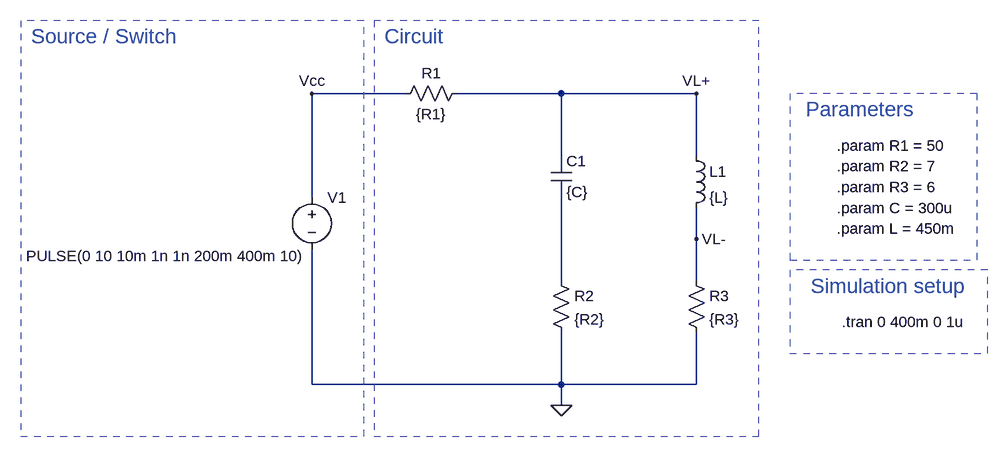
[diagram p0: schematic Simulacion SPICE - Valores Fijos.asc]
Simulacion SPICE - Valores Fijos.asc, the LTspice schematic file:
Version 4
SHEET 1 880 680
WIRE -368 -176 -512 -176
WIRE -128 -176 -288 -176
WIRE 80 -176 -128 -176
WIRE -128 -80 -128 -176
WIRE 80 -80 80 -176
WIRE -512 -16 -512 -176
WIRE 80 48 80 0
WIRE -128 112 -128 -16
WIRE 80 112 80 48
WIRE -512 272 -512 64
WIRE -128 272 -128 192
WIRE -128 272 -512 272
WIRE 80 272 80 192
WIRE 80 272 -128 272
WIRE -128 304 -128 272
FLAG -128 304 0
FLAG -512 -176 Vcc
FLAG 80 -176 VL+
FLAG 80 48 VL-
SYMBOL res -272 -192 R90
WINDOW 0 0 56 VBottom 2
WINDOW 3 32 56 VTop 2
SYMATTR InstName R1
SYMATTR Value {R1}
SYMBOL cap -144 -80 R0
SYMATTR InstName C1
SYMATTR Value {C}
SYMBOL res -144 96 R0
SYMATTR InstName R2
SYMATTR Value {R2}
SYMBOL res 64 96 R0
SYMATTR InstName R3
SYMATTR Value {R3}
SYMBOL ind 64 -96 R0
SYMATTR InstName L1
SYMATTR Value {L}
SYMBOL voltage -512 -32 R0
WINDOW 3 -440 106 Left 2
WINDOW 123 0 0 Left 0
WINDOW 39 0 0 Left 0
SYMATTR Value PULSE(0 10 10m 1n 1n 200m 400m 10)
SYMATTR InstName V1
TEXT 304 176 Left 2 !.tran 0 400m 0 1u
TEXT -400 -264 Left 3 ;Circuit
TEXT -944 -264 Left 3 ;Source / Switch
TEXT 248 -152 Left 3 ;Parameters
TEXT 296 -96 Left 2 !.param R1 = 50
TEXT 296 -64 Left 2 !.param R2 = 7
TEXT 296 -32 Left 2 !.param R3 = 6
TEXT 296 0 Left 2 !.param C = 300u
TEXT 296 32 Left 2 !.param L = 450m
TEXT 256 120 Left 3 ;Simulation setup
RECTANGLE Normal 176 -288 -416 352 2
RECTANGLE Normal -432 -288 -960 352 2
RECTANGLE Normal 512 -176 224 80 2
RECTANGLE Normal 528 96 224 224 2

The netlist it stands for:
* Simulacion SPICE - Valores Fijos.asc
R1 VL+ Vcc {R1}
C1 VL+ N001 {C}
R2 N001 0 {R2}
R3 VL- 0 {R3}
L1 VL+ VL- {L}
V1 Vcc 0 PULSE(0 10 10m 1n 1n 200m 400m 10)
.tran 0 400m 0 1u
* Circuit
* Source / Switch
* Parameters
.param R1 = 50
.param R2 = 7
.param R3 = 6
.param C = 300u
.param L = 450m
* Simulation setup
.backanno
.end